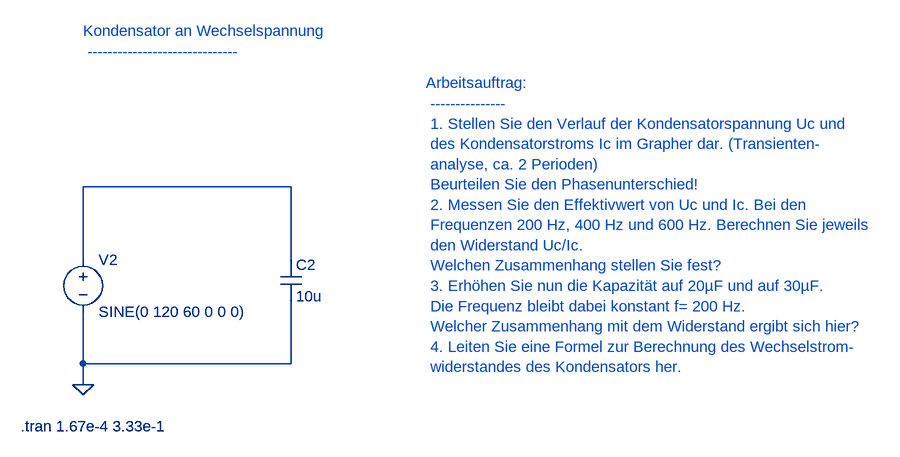
[diagram p0: schematic 10_3_C_an_Wechselspannung.asc]
10_3_C_an_Wechselspannung.asc, the LTspice schematic file:
Version 4
SHEET 1 880 680
WIRE 480 496 480 512
WIRE 160 512 160 528
WIRE 480 512 480 592
WIRE 480 592 160 592
WIRE 160 432 160 320
WIRE 160 320 480 320
WIRE 480 320 480 432
WIRE 160 592 160 624
WIRE 160 528 160 592
FLAG 160 624 0
SYMBOL cap 464 432 R0
SYMATTR InstName C2
SYMATTR Value 10u
SYMBOL voltage 160 416 R0
SYMATTR InstName V2
SYMATTR Value SINE(0 120 60 0 0 0)
TEXT 64 688 Left 2 !.tran 1.67e-4 3.33e-1
TEXT 160 80 Left 2 ;Kondensator an Wechselspannung \n ------------------------------
TEXT 688 160 Left 2 ;Arbeitsauftrag: \n --------------- \n 1. Stellen Sie den Verlauf der Kondensatorspannung Uc und \n des Kondensatorstroms Ic im Grapher dar. (Transienten- \n analyse, ca. 2 Perioden) \n Beurteilen Sie den Phasenunterschied! \n 2. Messen Sie den Effektivwert von Uc und Ic. Bei den \n Frequenzen 200 Hz, 400 Hz und 600 Hz. Berechnen Sie jeweils \n den Widerstand Uc/Ic. \n Welchen Zusammenhang stellen Sie fest? \n 3. Erhöhen Sie nun die Kapazität auf 20µF und auf 30µF. \n Die Frequenz bleibt dabei konstant f= 200 Hz. \n Welcher Zusammenhang mit dem Widerstand ergibt sich hier? \n 4. Leiten Sie eine Formel zur Berechnung des Wechselstrom- \n widerstandes des Kondensators her.

The netlist it stands for:
* 10_3_C_an_Wechselspannung.asc
C2 N001 0 10u
V2 N001 0 SINE(0 120 60 0 0 0)
.tran 1.67e-4 3.33e-1
* Kondensator an Wechselspannung
*  ------------------------------
* Arbeitsauftrag:
*  ---------------
*  1. Stellen Sie den Verlauf der Kondensatorspannung Uc und
*  des Kondensatorstroms Ic im Grapher dar. (Transienten-
*  analyse, ca. 2 Perioden)
*  Beurteilen Sie den Phasenunterschied!
*  2. Messen Sie den Effektivwert von Uc und Ic. Bei den
*  Frequenzen 200 Hz, 400 Hz und 600 Hz. Berechnen Sie jeweils
*  den Widerstand Uc/Ic.
*  Welchen Zusammenhang stellen Sie fest?
*  3. Erhöhen Sie nun die Kapazität auf 20µF und auf 30µF.
*  Die Frequenz bleibt dabei konstant f= 200 Hz.
*  Welcher Zusammenhang mit dem Widerstand ergibt sich hier?
*  4. Leiten Sie eine Formel zur Berechnung des Wechselstrom-
*  widerstandes des Kondensators her.
.backanno
.end